# EAGLE design jk flip-flop (EAGLE 9.6.2)
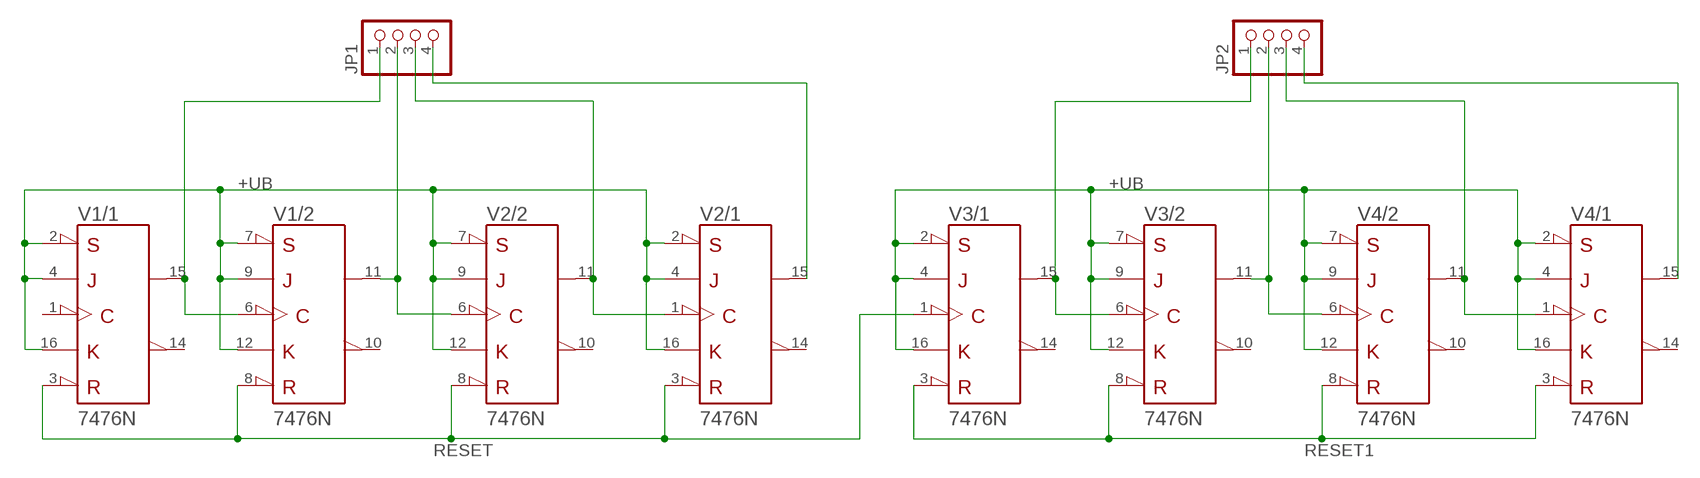
[diagram p0: schematic, sheet 1]

## Parts
JP1  PINHD-1X4  [1X04]
JP2  PINHD-1X4  [1X04]
V1  7476N  [DIL16]
V2  7476N  [DIL16]
V3  7476N  [DIL16]
V4  7476N  [DIL16]

## Nets
+UB: V1.2(/1:!PRE) V1.4(/1:J) V1.7(/2:!PRE) V1.9(/2:J) V1.12(/2:K) V1.16(/1:K) V2.2(/1:!PRE) V2.4(/1:J) V2.7(/2:!PRE) V2.9(/2:J) V2.12(/2:K) V2.16(/1:K) V3.2(/1:!PRE) V3.4(/1:J) V3.7(/2:!PRE) V3.9(/2:J) V3.12(/2:K) V3.16(/1:K) V4.2(/1:!PRE) V4.4(/1:J) V4.7(/2:!PRE) V4.9(/2:J) V4.12(/2:K) V4.16(/1:K)
N$1: JP2.1 V3.6(/2:CLK) V3.15(/1:Q)
N$2: JP2.2 V3.11(/2:Q) V4.6(/2:CLK)
N$3: JP1.4 V2.15(/1:Q)
N$4: JP1.1 V1.6(/2:CLK) V1.15(/1:Q)
N$5: JP1.2 V1.11(/2:Q) V2.6(/2:CLK)
N$6: JP1.3 V2.1(/1:CLK) V2.11(/2:Q)
N$7: JP2.3 V4.1(/1:CLK) V4.11(/2:Q)
N$9: JP2.4 V4.15(/1:Q)
RESET: V1.3(/1:!CLR) V1.8(/2:!CLR) V2.3(/1:!CLR) V2.8(/2:!CLR) V3.1(/1:CLK)
RESET1: V3.3(/1:!CLR) V3.8(/2:!CLR) V4.3(/1:!CLR) V4.8(/2:!CLR)
Unconnected: V1.1(/1:CLK) V1.10(/2:!Q) V1.14(/1:!Q) V2.10(/2:!Q) V2.14(/1:!Q) V3.10(/2:!Q) V3.14(/1:!Q) V4.10(/2:!Q) V4.14(/1:!Q)

## Power pins joined to a net without a drawn wire
+UB: V1.5(/+UB:+UB) V2.5(/+UB:+UB) V3.5(/+UB:+UB) V4.5(/+UB:+UB)
-UB: V1.13(/-UB:-UB) V2.13(/-UB:-UB) V3.13(/-UB:-UB) V4.13(/-UB:-UB)

## Library data of the parts
JP1 JP2 = pinhead:PINHD-1X4: PIN HEADER
V1-V4 = 74ttl-din:74*76: Dual J-K FLIP FLOP, preset and clear

## Board
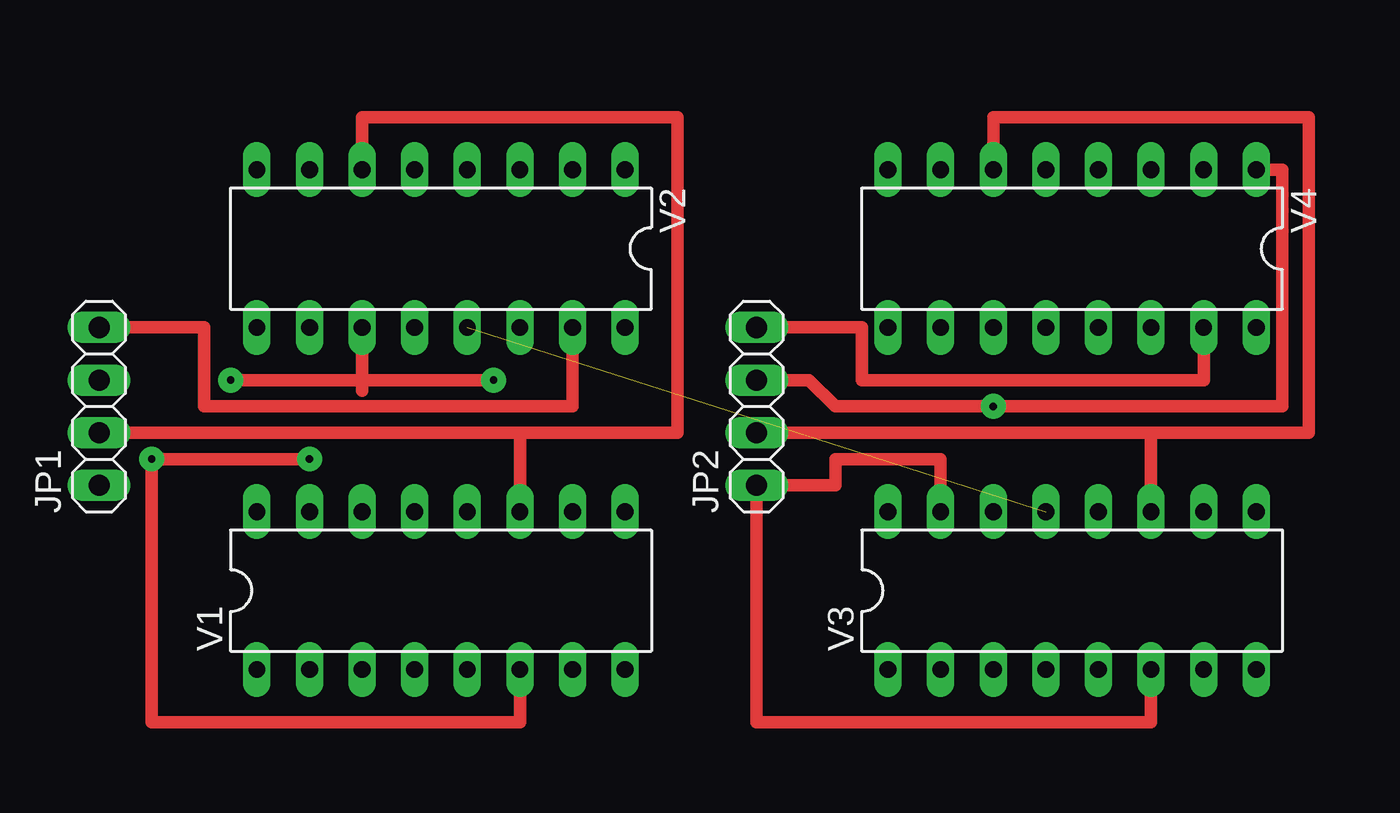
[diagram p1: board, top side]
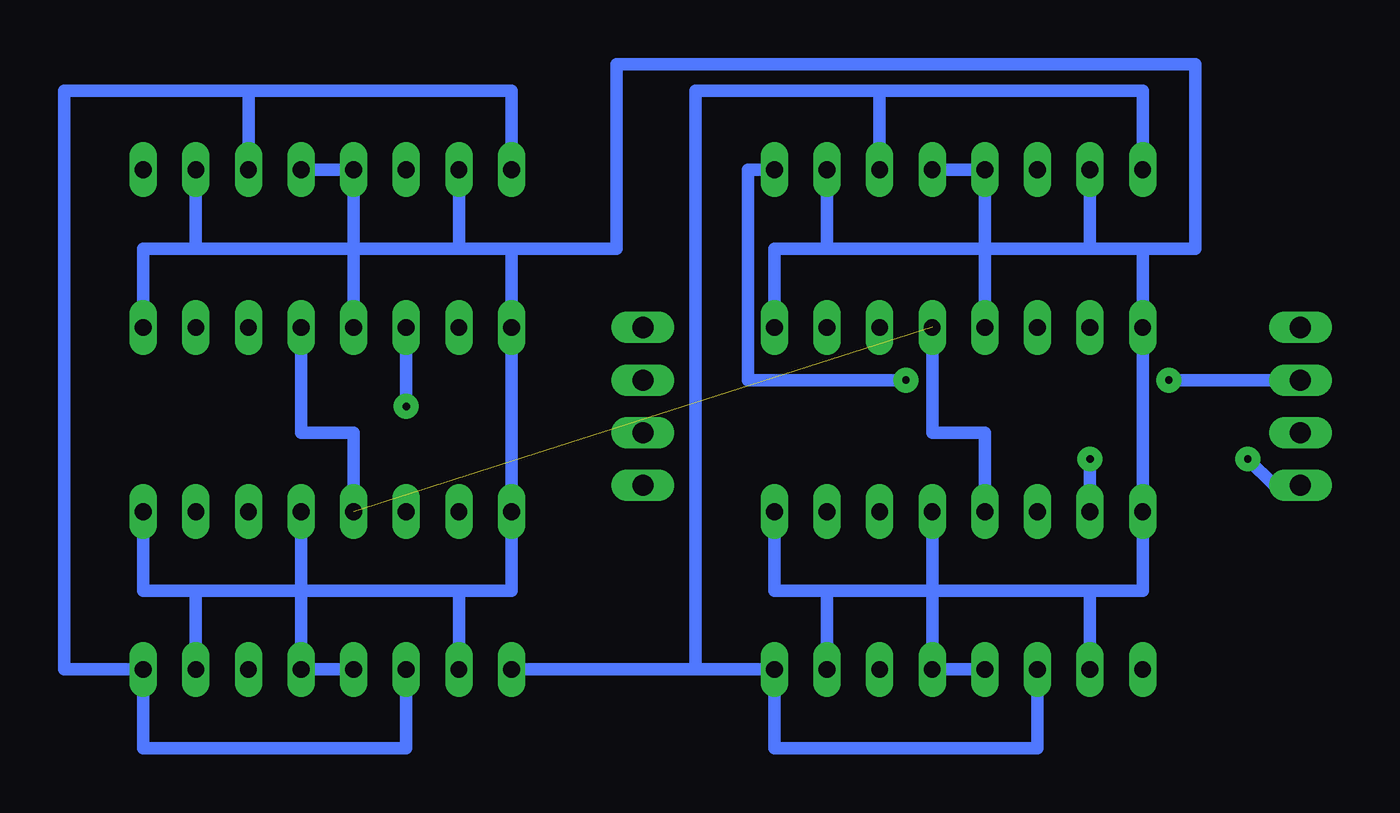
[diagram p2: board, bottom side, seen from below]

No outline drawn. Coordinates in mm, seen from the top.
Copper layers (1*16): Top 0.035mm / dielectric 1.5mm / Bottom 0.035mm
Design rules "default": minimum track width 6mil, minimum drill 0.35mm, track to track 6mil, track to pad 6mil, pad to pad 6mil, via to via 6mil, smd to smd 6mil, copper to edge 40mil, drill to drill 6mil, minimum pad ring 10mil, minimum via ring 8mil, stop-mask expansion 4mil, vias tented up to drill 0mil, thermal gap 10mil

### Footprints (pad centres in the part's own frame; a part is rotated, then mirrored left to right if it is on the bottom)
1X04 = drill 1.016 long: 1 -3.81,0; 2 -1.27,0; 3 1.27,0; 4 3.81,0
DIL16 = drill 0.813 long: 1 -8.89,-3.81; 2 -6.35,-3.81; 3 -3.81,-3.81; 4 -1.27,-3.81; 5 1.27,-3.81; 6 3.81,-3.81; 7 6.35,-3.81; 8 8.89,-3.81; 9 8.89,3.81; 10 6.35,3.81; 11 3.81,3.81; 12 1.27,3.81; 13 -1.27,3.81; 14 -3.81,3.81; 15 -6.35,3.81; 16 -8.89,3.81

### Placement (x,y rotation side)
JP1  12.7,43.18 90 top
JP2  44.45,43.18 90 top
V1  29.21,34.29 0 top
V2  29.21,50.8 180 top
V3  59.69,34.29 0 top
V4  59.69,50.8 180 top

### Tracks (layer width: path | path; a pad name or v marks a point on that pad's centre or on a via)
+UB
  Bottom 0.61: V1.4 V1.5 30.48,34.29 | 30.48,34.29 V1.12 | V1.7 35.56,34.29 | 35.56,34.29 30.48,34.29 | 35.56,34.29 38.1,34.29 V1.9 | 22.86,34.29 20.32,34.29 V1.16 V2.9 20.32,50.8 | 22.86,34.29 30.48,34.29 | V1.2 22.86,34.29 | 20.32,50.8 21.59,50.8 22.86,50.8 | 22.86,50.8 V2.7 | 22.86,50.8 27.94,50.8 | 27.94,50.8 V2.12 | 27.94,50.8 V2.5 V2.4 | V2.2 35.56,50.8 | 35.56,50.8 38.1,50.8 V2.16 | 35.56,50.8 27.94,50.8 | 60.96,34.29 V3.5 V3.4 | V3.12 60.96,34.29 | V3.9 68.58,34.29 66.04,34.29 | 66.04,34.29 60.96,34.29 | V3.7 66.04,34.29 | 60.96,34.29 53.34,34.29 | 53.34,34.29 50.8,34.29 V3.16 V4.9 50.8,50.8 | V3.2 53.34,34.29 | V4.7 53.34,50.8 | 50.8,50.8 53.34,50.8 | 53.34,50.8 58.42,50.8 | V4.12 58.42,50.8 | 58.42,50.8 V4.5 V4.4 | V4.16 68.58,50.8 66.04,50.8 | 66.04,50.8 58.42,50.8 | V4.2 66.04,50.8 | 20.32,50.8 17.78,50.8 17.78,59.69 45.72,59.69 45.72,50.8 50.8,50.8
-UB  (1 unrouted)
  Bottom 0.61: V2.13 30.48,41.91 27.94,41.91 V1.13 | V3.13 58.42,41.91 60.96,41.91 V4.13
N$1
  Top 0.61: V3.6 63.5,27.94 44.45,27.94 JP2.1 48.26,39.37 48.26,40.64 53.34,40.64 V3.15
N$2
  Top 0.61: JP2.2 63.5,41.91 | 63.5,41.91 V3.11 | V4.6 55.88,57.15 71.12,57.15 71.12,41.91 63.5,41.91
N$3
  Top 0.61: V2.15 35.56,43.18 17.78,43.18 17.78,46.99 JP1.4
N$4  (via drill 0.35 pad 1.2)
  Top 0.61: v22.86,40.64 v15.24,40.64 15.24,27.94 33.02,27.94 V1.6
  Bottom 0.61: V1.15 v22.86,40.64 | JP1.1 13.97,39.37 v15.24,40.64
N$5
  Top 0.61: 33.02,41.91 JP1.2 | 33.02,41.91 V1.11 | V2.6 25.4,57.15 40.64,57.15 40.64,41.91 33.02,41.91
N$6  (via drill 0.35 pad 1.2)
  Top 0.61: V2.11 25.4,44.45 | 25.4,43.94 25.4,44.45 | v19.05,44.45 25.4,44.45 | 25.4,44.45 v31.75,44.45
  Bottom 0.61: JP1.3 v19.05,44.45 | V2.1 39.37,54.61 39.37,44.45 v31.75,44.45
N$7  (via drill 0.35 pad 1.2)
  Top 0.61: JP2.3 46.99,44.45 48.26,43.18 v55.88,43.18 69.85,43.18 69.85,54.61 V4.1
  Bottom 0.61: v55.88,43.18 V4.11
N$9
  Top 0.61: V4.15 66.04,44.45 49.53,44.45 49.53,46.99 JP2.4
RESET
  Bottom 0.61: V1.3 25.4,26.67 38.1,26.67 V1.8 41.91,30.48 | V2.8 20.32,58.42 33.02,58.42 | 33.02,58.42 V2.3 | 33.02,58.42 41.91,58.42 41.91,30.48 | 41.91,30.48 V3.1
RESET1
  Bottom 0.61: V3.3 55.88,26.67 68.58,26.67 V3.8 72.39,30.48 72.39,58.42 63.5,58.42 | V4.8 50.8,58.42 63.5,58.42 | 63.5,58.42 V4.3